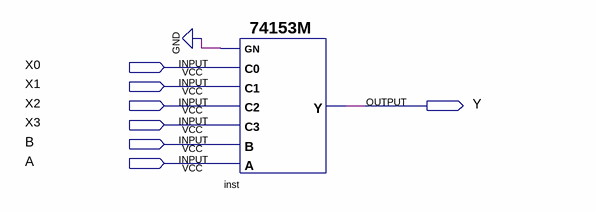
[diagram p0: schematic sheet]
// Quartus schematic 31.bdf as structural Verilog: 1 symbols, 7 pins
module \31  (
  input  X0,
  input  X1,
  input  X2,
  input  X3,
  input  B,
  input  A,
  output Y
);

  \74153M  inst (.A(A), .B(B), .C3(X3), .C2(X2), .C1(X1), .C0(X0), .GN(1'b0), .Y(Y));
endmodule
